# Altium schematic sheet AHRS_board.SchDoc
size A4
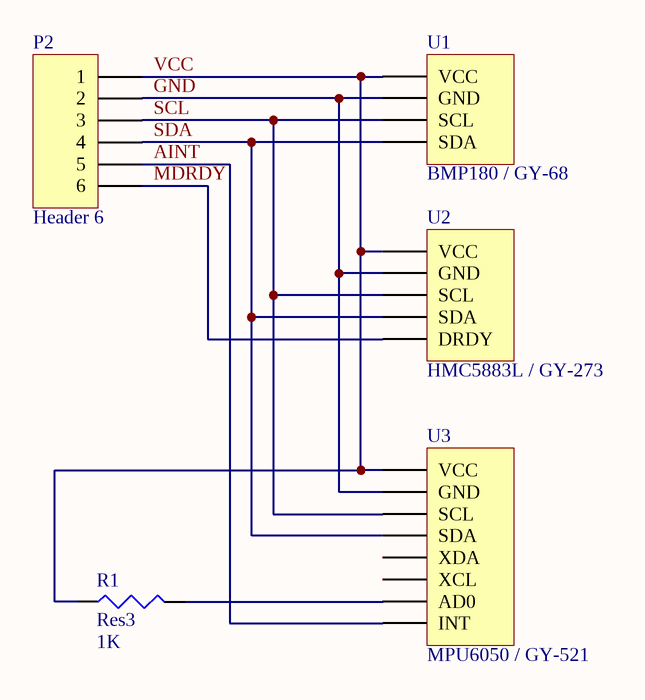
[diagram p0: AHRS_board.SchDoc]

## Parts
P2  Header 6  [HDR1X6]
R1  Res3  value 1K  [J1-0603]
U1  BMP180 / GY-68  [BMP180]
U2  HMC5883L / GY-273  [HMC5883L]
U3  MPU6050 / GY-521  [MPU6050]

## Nets
AINT: P2.5 U3.8(INT)
GND: P2.2 U1.2(GND) U2.2(GND) U3.2(GND)
MDRDY: P2.6 U2.5(DRDY)
SCL: P2.3 U1.3(SCL) U2.3(SCL) U3.3(SCL)
SDA: P2.4 U1.4(SDA) U2.4(SDA) U3.4(SDA)
VCC: P2.1 R1.1 U1.1(VCC) U2.1(VCC) U3.1(VCC)
NetR1_2: R1.2 U3.7(AD0)

Not connected (* = marked no-connect by the designer): U3 5(XDA) 6(XCL)

## Library data of the parts
P2 = Header 6: Header, 6-Pin; LatestRevisionDate: 17-Jul-2002; LatestRevisionNote: Re-released for DXP Platform.; Publisher: Altium Limited
R1 = Res3: Resistor; Published: 8-Jun-2000; LatestRevisionDate: 29-May-2009; LatestRevisionNote: IPC-7351 Footprint Added.; PackageReference: J1-0603; Publisher: Altium Limited; PackageDescription: Chip Resistor